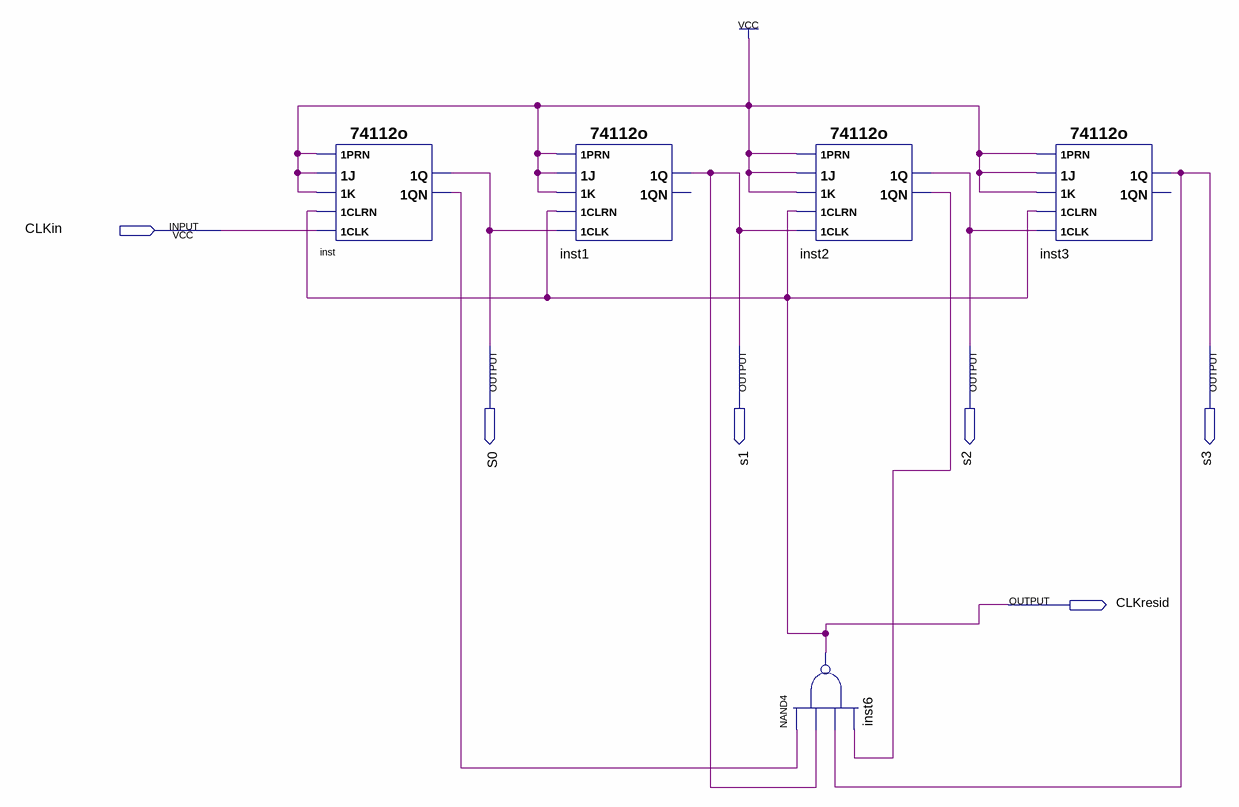
[diagram p0: schematic sheet]
// Quartus schematic ContadorUP.bdf as structural Verilog: 5 symbols, 6 pins
module ContadorUP (
  input  CLKin,
  output S0,
  output s1,
  output s2,
  output s3,
  output CLKresid
);

  wire inst2_1qn, inst_1qn;

  \74112o  inst (
    .\1PRN (1'b1), .\1CLK (CLKin), .\1CLRN (CLKresid), .\1J (1'b1), .\1K (1'b1), .\1QN (inst_1qn), .\1Q (S0));
  \74112o  inst1 (.\1PRN (1'b1), .\1CLK (S0), .\1CLRN (CLKresid), .\1J (1'b1), .\1K (1'b1), .\1Q (s1));  // open: 1QN
  \74112o  inst2 (
    .\1PRN (1'b1), .\1CLK (s1), .\1CLRN (CLKresid), .\1J (1'b1), .\1K (1'b1), .\1QN (inst2_1qn), .\1Q (s2));
  nand inst6 (CLKresid, inst_1qn, s1, s3, inst2_1qn);
  \74112o  inst3 (.\1PRN (1'b1), .\1CLK (s2), .\1CLRN (CLKresid), .\1J (1'b1), .\1K (1'b1), .\1Q (s3));  // open: 1QN
endmodule
